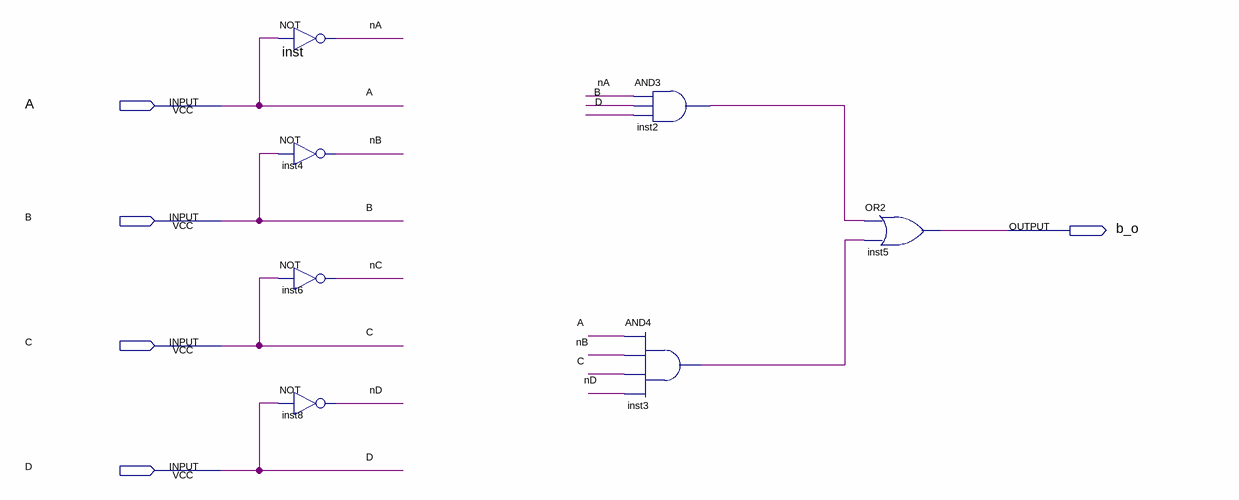
[diagram p0: schematic sheet]
// Quartus schematic b_out.bdf as structural Verilog: 7 symbols, 5 pins
module b_out (
  input  A,
  input  B,
  input  C,
  input  D,
  output b_o
);

  wire inst2_out, inst3_out, nA, nB, nC, nD;

  not inst (nA, A);
  not inst4 (nB, B);
  not inst6 (nC, C);
  not inst8 (nD, D);
  and inst2 (inst2_out, nA, B, D);
  and inst3 (inst3_out, A, nB, C, nD);
  or inst5 (b_o, inst2_out, inst3_out);
endmodule
